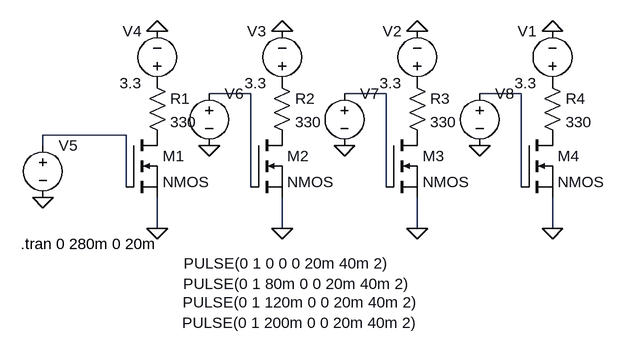
[diagram p0: schematic standard_set_of_nmos.asc]
standard_set_of_nmos.asc, the LTspice schematic file:
Version 4
SHEET 1 892 680
WIRE 128 128 64 128
WIRE 336 128 272 128
WIRE 544 128 480 128
WIRE -64 192 -192 192
WIRE -192 208 -192 192
WIRE -64 272 -64 192
WIRE 128 272 128 128
WIRE 336 272 336 128
WIRE 544 272 544 128
WIRE -16 336 -16 288
WIRE 176 336 176 288
WIRE 384 336 384 288
WIRE 592 336 592 288
FLAG -16 336 0
FLAG 176 336 0
FLAG 384 336 0
FLAG 592 336 0
FLAG -16 32 0
FLAG 176 32 0
FLAG 384 32 0
FLAG 592 32 0
FLAG -192 288 0
FLAG 64 208 0
FLAG 272 208 0
FLAG 480 208 0
SYMBOL voltage 592 128 R180
WINDOW 0 24 96 Left 2
WINDOW 3 24 16 Left 2
WINDOW 123 0 0 Left 0
WINDOW 39 0 0 Left 0
SYMATTR InstName V1
SYMATTR Value 3.3
SYMBOL voltage 384 128 R180
WINDOW 0 24 96 Left 2
WINDOW 3 24 16 Left 2
WINDOW 123 0 0 Left 0
WINDOW 39 0 0 Left 0
SYMATTR InstName V2
SYMATTR Value 3.3
SYMBOL voltage 176 128 R180
WINDOW 0 24 96 Left 2
WINDOW 3 24 16 Left 2
WINDOW 123 0 0 Left 0
WINDOW 39 0 0 Left 0
SYMATTR InstName V3
SYMATTR Value 3.3
SYMBOL voltage -16 128 R180
WINDOW 0 24 96 Left 2
WINDOW 3 24 16 Left 2
WINDOW 123 0 0 Left 0
WINDOW 39 0 0 Left 0
SYMATTR InstName V4
SYMATTR Value 3.3
SYMBOL nmos -64 192 R0
SYMATTR InstName M1
SYMBOL nmos 128 192 R0
SYMATTR InstName M2
SYMBOL nmos 336 192 R0
SYMATTR InstName M3
SYMBOL nmos 544 192 R0
SYMATTR InstName M4
SYMBOL voltage -192 192 R0
WINDOW 3 217 198 Left 2
WINDOW 123 0 0 Left 0
WINDOW 39 0 0 Left 0
SYMATTR InstName V5
SYMATTR Value PULSE(0 1 0 0 0 20m 40m 2)
SYMBOL voltage 64 112 R0
WINDOW 3 -40 309 Left 2
WINDOW 123 0 0 Left 0
WINDOW 39 0 0 Left 0
SYMATTR InstName V6
SYMATTR Value PULSE(0 1 80m 0 0 20m 40m 2)
SYMBOL voltage 272 112 R0
WINDOW 3 -249 338 Left 2
WINDOW 123 0 0 Left 0
WINDOW 39 0 0 Left 0
SYMATTR InstName V7
SYMATTR Value PULSE(0 1 120m 0 0 20m 40m 2)
SYMBOL voltage 480 112 R0
WINDOW 3 -458 369 Left 2
WINDOW 123 0 0 Left 0
WINDOW 39 0 0 Left 0
SYMATTR InstName V8
SYMATTR Value PULSE(0 1 200m 0 0 20m 40m 2)
SYMBOL res -32 96 R0
SYMATTR InstName R1
SYMATTR Value 330
SYMBOL res 160 96 R0
SYMATTR InstName R2
SYMATTR Value 330
SYMBOL res 368 96 R0
SYMATTR InstName R3
SYMATTR Value 330
SYMBOL res 576 96 R0
SYMATTR InstName R4
SYMATTR Value 330
TEXT -226 360 Left 2 !.tran 0 280m 0 20m

The netlist it stands for:
* standard_set_of_nmos.asc
V1 P001 0 3.3
V2 P002 0 3.3
V3 P003 0 3.3
V4 P004 0 3.3
M1 P005 N004 0 0 NMOS
M2 P006 N001 0 0 NMOS
M3 P007 N002 0 0 NMOS
M4 P008 N003 0 0 NMOS
V5 N004 0 PULSE(0 1 0 0 0 20m 40m 2)
V6 N001 0 PULSE(0 1 80m 0 0 20m 40m 2)
V7 N002 0 PULSE(0 1 120m 0 0 20m 40m 2)
V8 N003 0 PULSE(0 1 200m 0 0 20m 40m 2)
R1 P004 P005 330
R2 P003 P006 330
R3 P002 P007 330
R4 P001 P008 330
.model NMOS NMOS
.model PMOS PMOS
.lib standard.mos
.tran 0 280m 0 20m
.backanno
.end